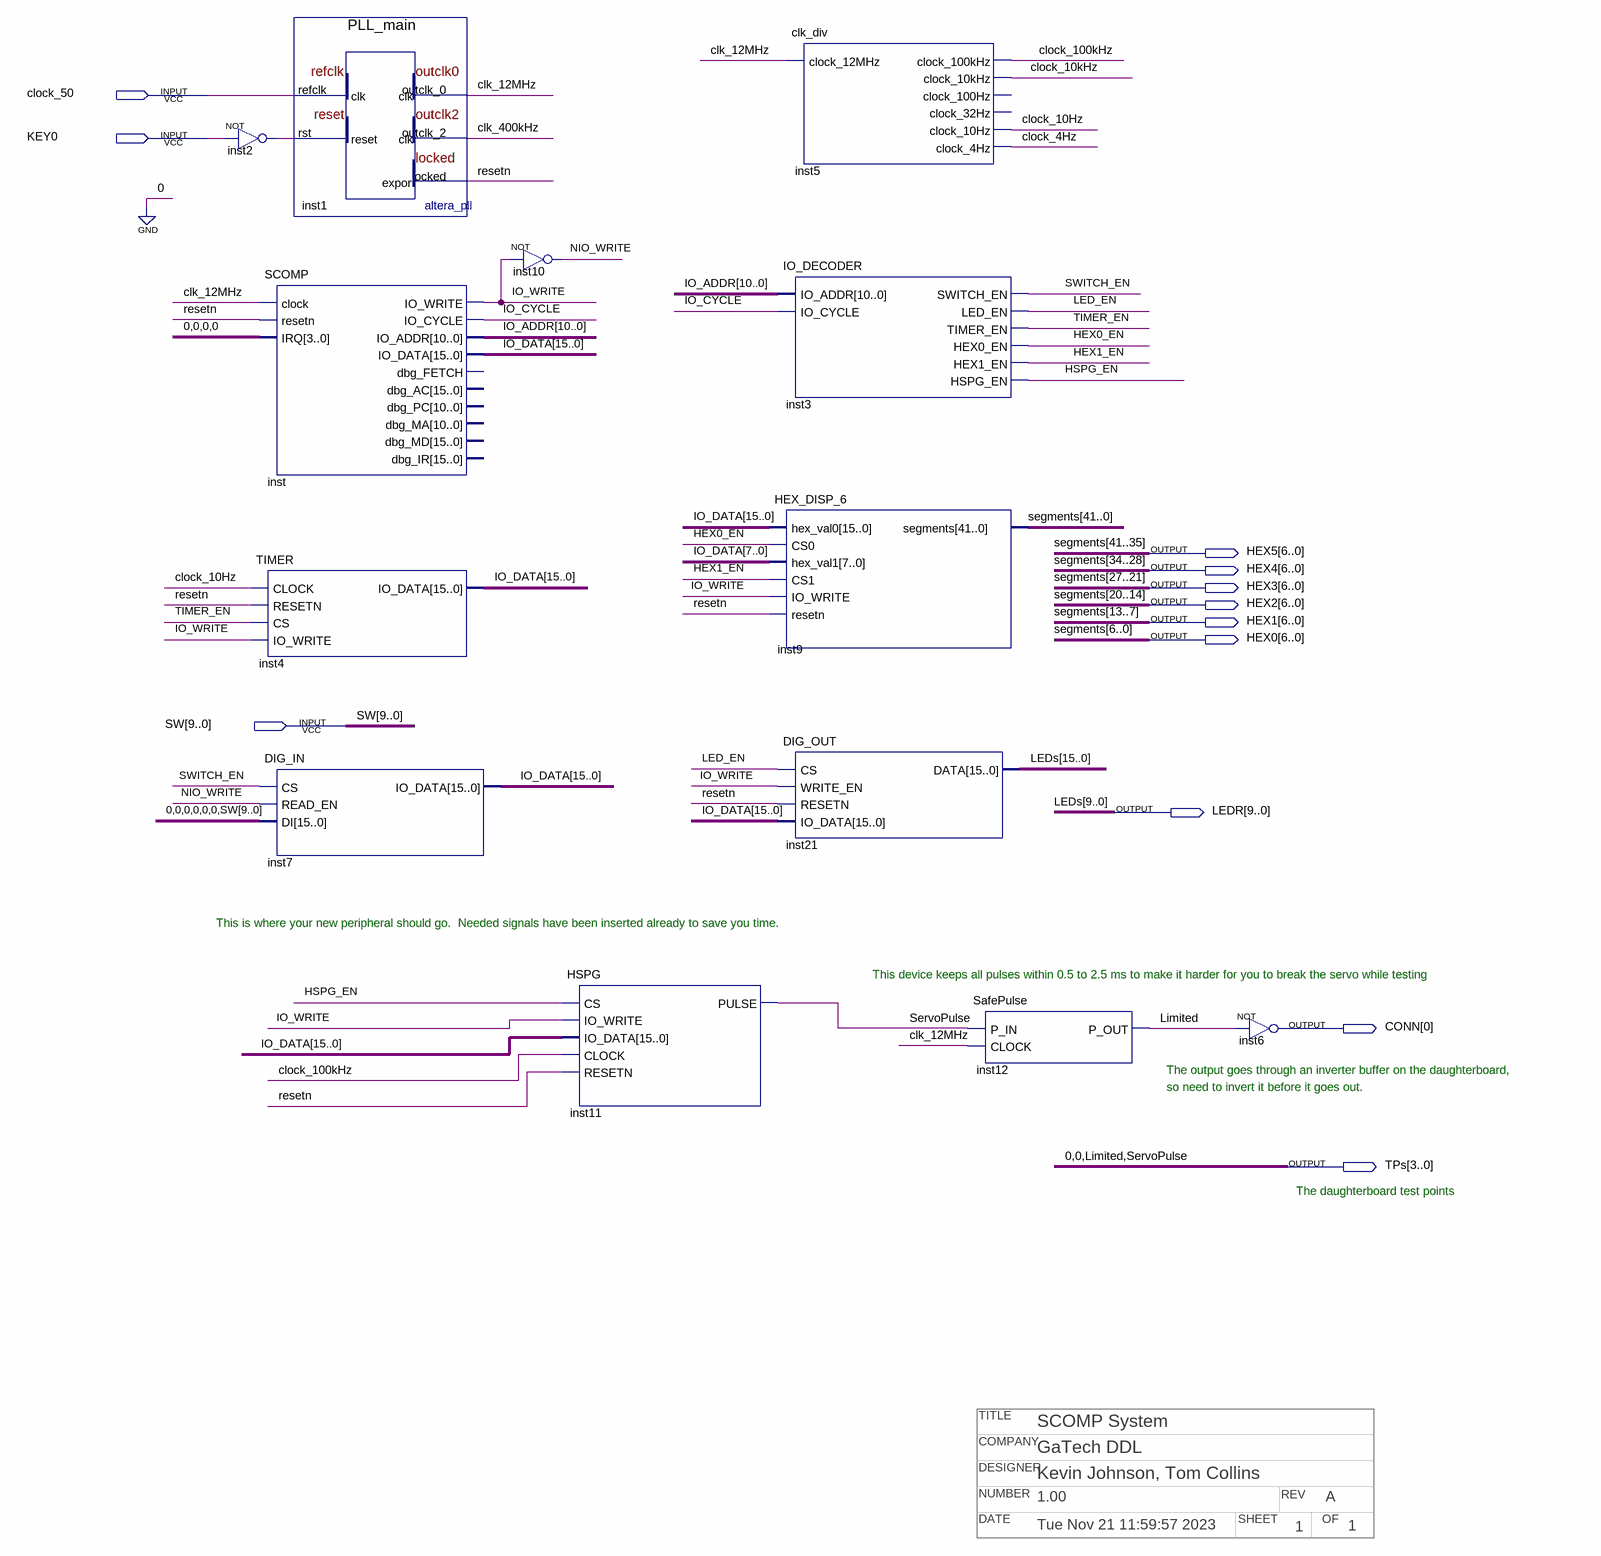
[diagram p0: schematic sheet]
// Quartus schematic SCOMP_System.bdf as structural Verilog: 13 symbols, 12 pins
// Title block: TITLE: SCOMP System; COMPANY: GaTech DDL; DESIGNER: Kevin Johnson, Tom Collins; NUMBER: 1.00; REV: A; DATE: Tue Nov 21 11:59:57 2023; SHEET: 1; OF: 1
module SCOMP_System (
  input  clock_50,
  input  KEY0,
  input  [9:0] SW,
  output [6:0] HEX5,
  output [6:0] HEX4,
  output [6:0] HEX3,
  output [6:0] HEX2,
  output [6:0] HEX1,
  output [6:0] HEX0,
  output [9:0] LEDR,
  output [0:0] CONN,
  output [3:0] TPs
);

  wire clk_12MHz, clk_400kHz, clock_4Hz, clock_10Hz, clock_10kHz, clock_100kHz, HEX0_EN, HEX1_EN, HSPG_EN,
       inst2_out, IO_CYCLE, IO_WRITE, LED_EN, NIO_WRITE, resetn, SWITCH_EN, TIMER_EN;
  wire [10:0] IO_ADDR;
  wire [15:0] IO_DATA;
  wire [15:10] LEDs;

  not inst2 (inst2_out, KEY0);
  SCOMP inst (
    .clock(clk_12MHz), .resetn(resetn), .IRQ(4'b0000), .IO_WRITE(IO_WRITE), .IO_CYCLE(IO_CYCLE),
    .IO_ADDR(IO_ADDR), .IO_DATA(IO_DATA));  // open: dbg_FETCH, dbg_AC, dbg_PC, dbg_MA, dbg_MD, dbg_IR
  TIMER inst4 (.CLOCK(clock_10Hz), .RESETN(resetn), .CS(TIMER_EN), .IO_WRITE(IO_WRITE), .IO_DATA(IO_DATA));
  DIG_IN inst7 (.CS(SWITCH_EN), .READ_EN(NIO_WRITE), .DI({{6{1'b0}}, SW}), .IO_DATA(IO_DATA));
  PLL_main inst1 (.refclk(clock_50), .rst(inst2_out), .outclk_0(clk_12MHz), .outclk_2(clk_400kHz), .locked(resetn));
  not inst10 (NIO_WRITE, IO_WRITE);
  HSPG inst11 (
    .CS(HSPG_EN), .IO_WRITE(IO_WRITE), .IO_DATA(IO_DATA), .CLOCK(clock_100kHz), .RESETN(resetn),
    .PULSE(TPs[0]));
  clk_div inst5 (
    .clock_12MHz(clk_12MHz), .clock_100kHz(clock_100kHz), .clock_10kHz(clock_10kHz), .clock_10Hz(clock_10Hz),
    .clock_4Hz(clock_4Hz));  // open: clock_100Hz, clock_32Hz
  IO_DECODER inst3 (
    .IO_ADDR(IO_ADDR), .IO_CYCLE(IO_CYCLE), .SWITCH_EN(SWITCH_EN), .LED_EN(LED_EN), .TIMER_EN(TIMER_EN),
    .HEX0_EN(HEX0_EN), .HEX1_EN(HEX1_EN), .HSPG_EN(HSPG_EN));
  HEX_DISP_6 inst9 (
    .hex_val0(IO_DATA), .CS0(HEX0_EN), .hex_val1(IO_DATA[7:0]), .CS1(HEX1_EN), .IO_WRITE(IO_WRITE),
    .resetn(resetn), .segments({HEX5, HEX4, HEX3, HEX2, HEX1, HEX0}));
  DIG_OUT inst21 (.CS(LED_EN), .WRITE_EN(IO_WRITE), .RESETN(resetn), .IO_DATA(IO_DATA), .DATA({LEDs, LEDR}));
  SafePulse inst12 (.P_IN(TPs[0]), .CLOCK(clk_12MHz), .P_OUT(TPs[1]));
  not inst6 (CONN[0], TPs[1]);

  assign TPs[3:2] = 2'b00;

  // Other names for the same wires on the sheet: LEDs[9:0] = LEDR; Limited = TPs[1];
  //   segments[41:0] = {HEX5, HEX4, HEX3, HEX2, HEX1, HEX0}; ServoPulse = TPs[0]

  // Notes on the sheet:
  //   This is where your new peripheral should go.  Needed signals have been inserted already to save you time.
  //   This device keeps all pulses within 0.5 to 2.5 ms to make it harder for you to break the servo while testing
  //   The output goes through an inverter buffer on the daughterboard,
  //   so need to invert it before it goes out.
  //   The daughterboard test points
endmodule
